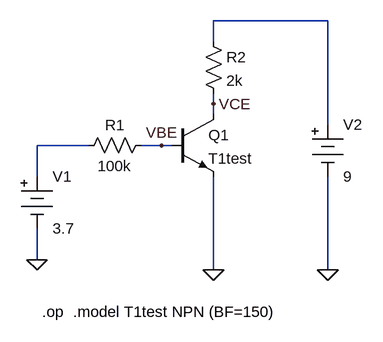
[diagram p0: schematic 3_12_tp3_ej3_1_pablo_gomez.asc]
3_12_tp3_ej3_1_pablo_gomez.asc, the LTspice schematic file:
Version 4
SHEET 1 880 680
WIRE 496 -128 320 -128
WIRE 320 -96 320 -128
WIRE 320 0 320 -16
WIRE 320 16 320 0
WIRE 496 32 496 -128
WIRE 128 64 48 64
WIRE 240 64 208 64
WIRE 256 64 240 64
WIRE 48 112 48 64
WIRE 48 240 48 192
WIRE 320 256 320 112
WIRE 496 256 496 112
FLAG 496 256 0
FLAG 320 256 0
FLAG 48 240 0
FLAG 240 64 VBE
FLAG 320 0 VCE
SYMBOL res 112 80 R270
WINDOW 0 32 56 VTop 2
WINDOW 3 0 56 VBottom 2
SYMATTR InstName R1
SYMATTR Value 100k
SYMBOL res 304 -112 R0
SYMATTR InstName R2
SYMATTR Value 2k
SYMBOL npn 256 16 R0
SYMATTR InstName Q1
SYMATTR Value T1test
SYMBOL Misc\\battery 496 16 R0
WINDOW 123 0 0 Left 0
WINDOW 39 0 0 Left 0
SYMATTR InstName V2
SYMATTR Value 9
SYMBOL Misc\\battery 48 96 R0
WINDOW 123 0 0 Left 0
WINDOW 39 0 0 Left 0
SYMATTR InstName V1
SYMATTR Value 3.7
TEXT 104 320 Left 2 !.model T1test NPN (BF=150)
TEXT 56 320 Left 2 !.op

The netlist it stands for:
* 3_12_tp3_ej3_1_pablo_gomez.asc
R1 N002 VBE 100k
R2 N001 VCE 2k
Q1 VCE VBE 0 0 T1test
V2 N001 0 9
V1 N002 0 3.7
.model NPN NPN
.model PNP PNP
.lib standard.bjt
.model T1test NPN (BF=150)
.op
.backanno
.end